# EAGLE design BOB_O1000-W29Y2011 (EAGLE 5.10)
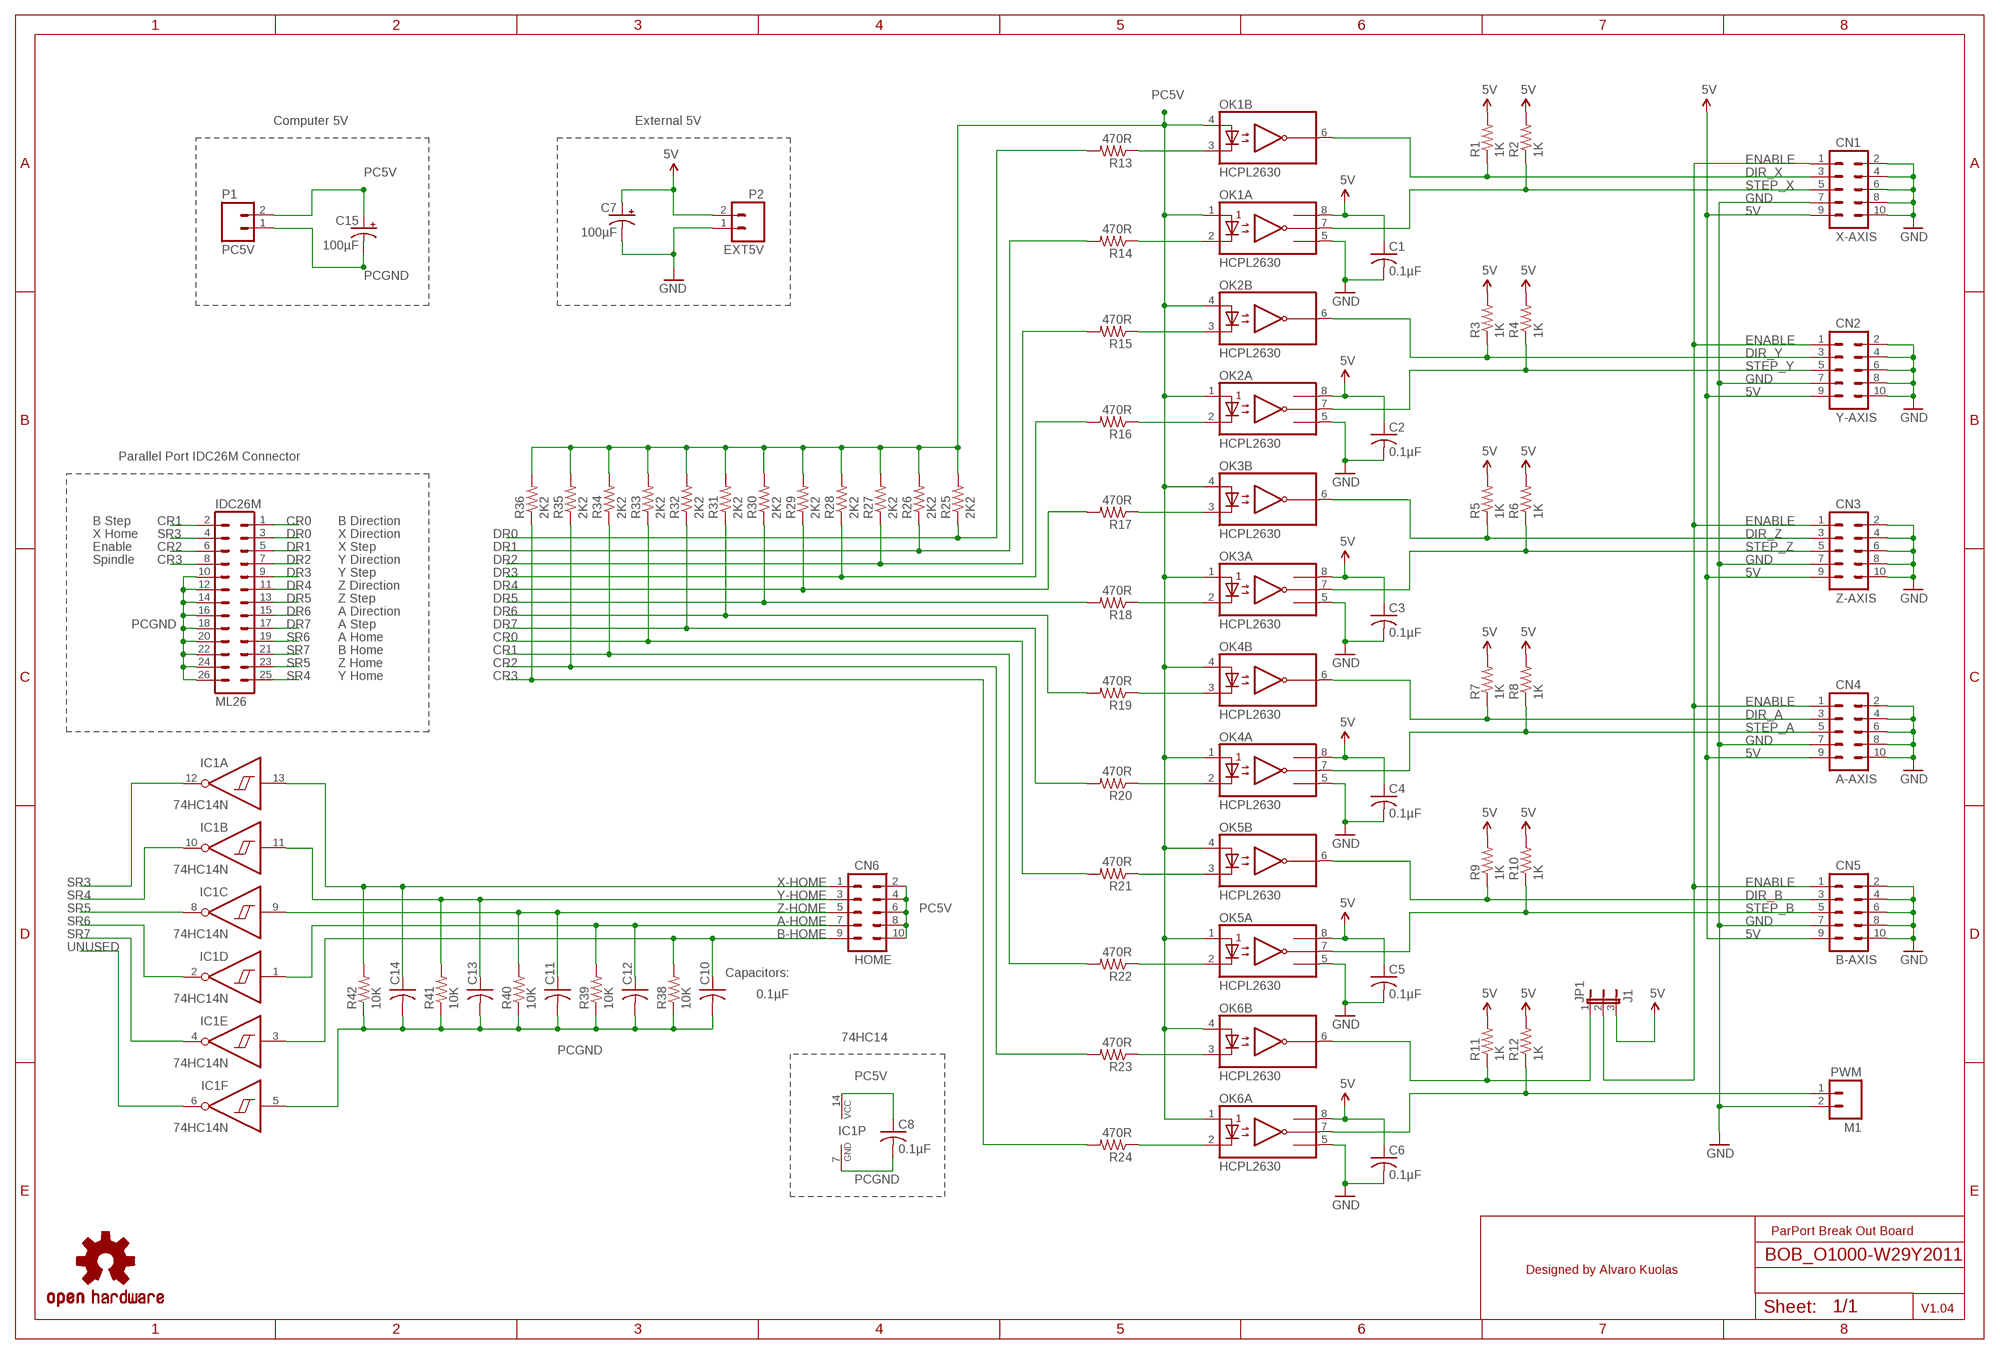
[diagram p0: schematic, sheet 1]

## Parts
C1  0.1µF  C-US050-024X044  [C050-024X044]
C2  0.1µF  C-US050-024X044  [C050-024X044]
C3  0.1µF  C-US050-024X044  [C050-024X044]
C4  0.1µF  C-US050-024X044  [C050-024X044]
C5  0.1µF  C-US050-024X044  [C050-024X044]
C6  0.1µF  C-US050-024X044  [C050-024X044]
C7  100µF  CPOL-USE5-10.5  [E5-10,5]
C8  0.1µF  C-US050-024X044  [C050-024X044]
C10  0.1µF  C-US050-024X044  [C050-024X044]
C11  0.1µF  C-US050-024X044  [C050-024X044]
C12  0.1µF  C-US050-024X044  [C050-024X044]
C13  0.1µF  C-US050-024X044  [C050-024X044]
C14  0.1µF  C-US050-024X044  [C050-024X044]
C15  100µF  CPOL-USE5-10.5  [E5-10,5]
CN1  X-AXIS  M05X2SHD  [2X5-SHROUDED]
CN2  Y-AXIS  M05X2SHD  [2X5-SHROUDED]
CN3  Z-AXIS  M05X2SHD  [2X5-SHROUDED]
CN4  A-AXIS  M05X2SHD  [2X5-SHROUDED]
CN5  B-AXIS  M05X2SHD  [2X5-SHROUDED]
CN6  HOME  M05X2SHD  [2X5-SHROUDED]
IC1  74HC14N  [DIL14]
JP1  J1  JUMPER-3PTH  [1X03]
M1  PWM  M02PTH  [1X02]
ML26  IDC26M  ML26  [ML26]
OK1  HCPL2630  [DIL08]
OK2  HCPL2630  [DIL08]
OK3  HCPL2630  [DIL08]
OK4  HCPL2630  [DIL08]
OK5  HCPL2630  [DIL08]
OK6  HCPL2630  [DIL08]
P1  PC5V  M023.5MM  [SCREWTERMINAL-3.5MM-2]
P2  EXT5V  M023.5MM  [SCREWTERMINAL-3.5MM-2]
R1  1K  R-US_0204/5  [0204/5]
R2  1K  R-US_0204/5  [0204/5]
R3  1K  R-US_0204/5  [0204/5]
R4  1K  R-US_0204/5  [0204/5]
R5  1K  R-US_0204/5  [0204/5]
R6  1K  R-US_0204/5  [0204/5]
R7  1K  R-US_0204/5  [0204/5]
R8  1K  R-US_0204/5  [0204/5]
R9  1K  R-US_0204/5  [0204/5]
R10  1K  R-US_0204/5  [0204/5]
R11  1K  R-US_0204/5  [0204/5]
R12  1K  R-US_0204/5  [0204/5]
R13  470R  R-US_0204/5  [0204/5]
R14  470R  R-US_0204/5  [0204/5]
R15  470R  R-US_0204/5  [0204/5]
R16  470R  R-US_0204/5  [0204/5]
R17  470R  R-US_0204/5  [0204/5]
R18  470R  R-US_0204/5  [0204/5]
R19  470R  R-US_0204/5  [0204/5]
R20  470R  R-US_0204/5  [0204/5]
R21  470R  R-US_0204/5  [0204/5]
R22  470R  R-US_0204/5  [0204/5]
R23  470R  R-US_0204/5  [0204/5]
R24  470R  R-US_0204/5  [0204/5]
R25  2K2  R-US_0204/5  [0204/5]
R26  2K2  R-US_0204/5  [0204/5]
R27  2K2  R-US_0204/5  [0204/5]
R28  2K2  R-US_0204/5  [0204/5]
R29  2K2  R-US_0204/5  [0204/5]
R30  2K2  R-US_0204/5  [0204/5]
R31  2K2  R-US_0204/5  [0204/5]
R32  2K2  R-US_0204/5  [0204/5]
R33  2K2  R-US_0204/5  [0204/5]
R34  2K2  R-US_0204/5  [0204/5]
R35  2K2  R-US_0204/5  [0204/5]
R36  2K2  R-US_0204/5  [0204/5]
R38  10K  R-US_0204/5  [0204/5]
R39  10K  R-US_0204/5  [0204/5]
R40  10K  R-US_0204/5  [0204/5]
R41  10K  R-US_0204/5  [0204/5]
R42  10K  R-US_0204/5  [0204/5]
U$24  OSHW-LOGOL  [OSHW-LOGO-L]

## Nets
5V: C1.1 C2.1 C3.1 C4.1 C5.1 C6.1 C7.+ CN1.9 CN2.9 CN3.9 CN4.9 CN5.9 JP1.3 OK1.8(A:VCC) OK2.8(A:VCC) OK3.8(A:VCC) OK4.8(A:VCC) OK5.8(A:VCC) OK6.8(A:VCC) P2.2 R1.2 R2.2 R3.2 R4.2 R5.2 R6.2 R7.2 R8.2 R9.2 R10.2 R11.2 R12.2
A-HOME: C12.1 CN6.7 IC1.1(D:I) R39.2
B-HOME: C10.1 CN6.9 IC1.3(E:I) R38.2
CR0: ML26.1 R21.2 R33.1
CR1: ML26.2 R22.2 R34.1
CR2: ML26.6 R23.2 R35.1
CR3: ML26.8 R24.2 R36.1
DIR_A: CN4.3 OK4.6(B:VO2) R7.1
DIR_B: CN5.3 OK5.6(B:VO2) R9.1
DIR_X: CN1.3 OK1.6(B:VO2) R1.1
DIR_Y: CN2.3 OK2.6(B:VO2) R3.1
DIR_Z: CN3.3 OK3.6(B:VO2) R5.1
DR0: ML26.3 R13.2 R25.1
DR1: ML26.5 R14.2 R26.1
DR2: ML26.7 R15.2 R27.1
DR3: ML26.9 R16.2 R28.1
DR4: ML26.11 R17.2 R29.1
DR5: ML26.13 R18.2 R30.1
DR6: ML26.15 R19.2 R31.1
DR7: ML26.17 R20.2 R32.1
ENABLE: CN1.1 CN2.1 CN3.1 CN4.1 CN5.1 JP1.2
GND: C1.2 C2.2 C3.2 C4.2 C5.2 C6.2 C7.- CN1.2 CN1.4 CN1.6 CN1.7 CN1.8 CN1.10 CN2.2 CN2.4 CN2.6 CN2.7 CN2.8 CN2.10 CN3.2 CN3.4 CN3.6 CN3.7 CN3.8 CN3.10 CN4.2 CN4.4 CN4.6 CN4.7 CN4.8 CN4.10 CN5.2 CN5.4 CN5.6 CN5.7 CN5.8 CN5.10 M1.2 OK1.5(A:GND) OK2.5(A:GND) OK3.5(A:GND) OK4.5(A:GND) OK5.5(A:GND) OK6.5(A:GND) P2.1
N$1: OK6.2(A:C1) R24.1
N$2: JP1.1 OK6.6(B:VO2) R11.1
N$3: M1.1 OK6.7(A:VO1) R12.1
N$4: OK6.3(B:C2) R23.1
N$5: OK1.2(A:C1) R14.1
N$6: OK1.3(B:C2) R13.1
N$17: OK2.3(B:C2) R15.1
N$18: OK2.2(A:C1) R16.1
N$19: OK3.3(B:C2) R17.1
N$20: OK3.2(A:C1) R18.1
N$21: OK4.3(B:C2) R19.1
N$22: OK4.2(A:C1) R20.1
N$23: OK5.3(B:C2) R21.1
N$24: OK5.2(A:C1) R22.1
PC5V: C8.1 C15.+ CN6.2 CN6.4 CN6.6 CN6.8 CN6.10 IC1.14(P:VCC) OK1.1(A:A1) OK1.4(B:A2) OK2.1(A:A1) OK2.4(B:A2) OK3.1(A:A1) OK3.4(B:A2) OK4.1(A:A1) OK4.4(B:A2) OK5.1(A:A1) OK5.4(B:A2) OK6.1(A:A1) OK6.4(B:A2) P1.2 R25.2 R26.2 R27.2 R28.2 R29.2 R30.2 R31.2 R32.2 R33.2 R34.2 R35.2 R36.2
PCGND: C8.2 C10.2 C11.2 C12.2 C13.2 C14.2 C15.- IC1.5(F:I) IC1.7(P:GND) ML26.10 ML26.12 ML26.14 ML26.16 ML26.18 ML26.20 ML26.22 ML26.24 ML26.26 P1.1 R38.1 R39.1 R40.1 R41.1 R42.1
SR3: IC1.12(A:O) ML26.4
SR4: IC1.10(B:O) ML26.25
SR5: IC1.8(C:O) ML26.23
SR6: IC1.2(D:O) ML26.19
SR7: IC1.4(E:O) ML26.21
STEP_A: CN4.5 OK4.7(A:VO1) R8.1
STEP_B: CN5.5 OK5.7(A:VO1) R10.1
STEP_X: CN1.5 OK1.7(A:VO1) R2.1
STEP_Y: CN2.5 OK2.7(A:VO1) R4.1
STEP_Z: CN3.5 OK3.7(A:VO1) R6.1
UNUSED: IC1.6(F:O)
X-HOME: C14.1 CN6.1 IC1.13(A:I) R42.2
Y-HOME: C13.1 CN6.3 IC1.11(B:I) R41.2
Z-HOME: C11.1 CN6.5 IC1.9(C:I) R40.2

## Notes on the sheet
- Computer 5V | External 5V
- Parallel Port IDC26M Connector
- B Step | B Direction
- X Home | X Direction
- Enable | X Step
- Spindle | Y Direction
- Y Step
- Z Direction
- Z Step
- A Direction
- A Step
- A Home
- B Home
- Z Home
- Y Home
- Capacitors:
- 74HC14
- ParPort Break Out Board
- Designed by Alvaro Kuolas
- V1.04

## Library data of the parts
C1-C6 C8 C10-C14 = rcl-2:C-US: CAPACITOR, American symbol
C7 C15 = rcl-2:CPOL-US: POLARIZED CAPACITOR, American symbol
CN1-CN6 = SparkFun:M05X2: Header 5x2 Standard 10-pin dual row 0.1" header. Commonly used with AVR-ISP. Use with Spark Fun Electronics SKU: PRT-00778
IC1 = 74xx-eu:74*14: Hex schmitt trigger INVERTER
JP1 = SparkFun:JUMPER-3
M1 P1 P2 = SparkFun:M02: Header 2 Standard 2-pin 0.1" header. Use with straight break away headers (SKU : PRT-00116), right angle break away headers (PRT-00553), swiss pins (PRT-00743), machine pins (PRT-00117), and female headers (PRT-00115). Molex polarized connector foot print use with SKU : PRT-08233 with associated crimp pins and housings.
ML26 = con-harting-ml:ML26: HARTING
OK1-OK5 = optocoupler-2:HCPL2630: HEWLETT PACKARD OPTO COUPLER
OK6 = optocoupler:HCPL2630: HEWLETT PACKARD OPTO COUPLER
R1-R36 R38-R42 = rcl-2:R-US_: RESISTOR, American symbol
U$24 = SparkFun:OSHW-LOGO: Open Source Hardware Logo This logo indicates the piece of hardware it is found on incorporates a OSHW license and/or adheres to the definition of open source hardware found here: http://freedomdefined.org/OSHW

## Board
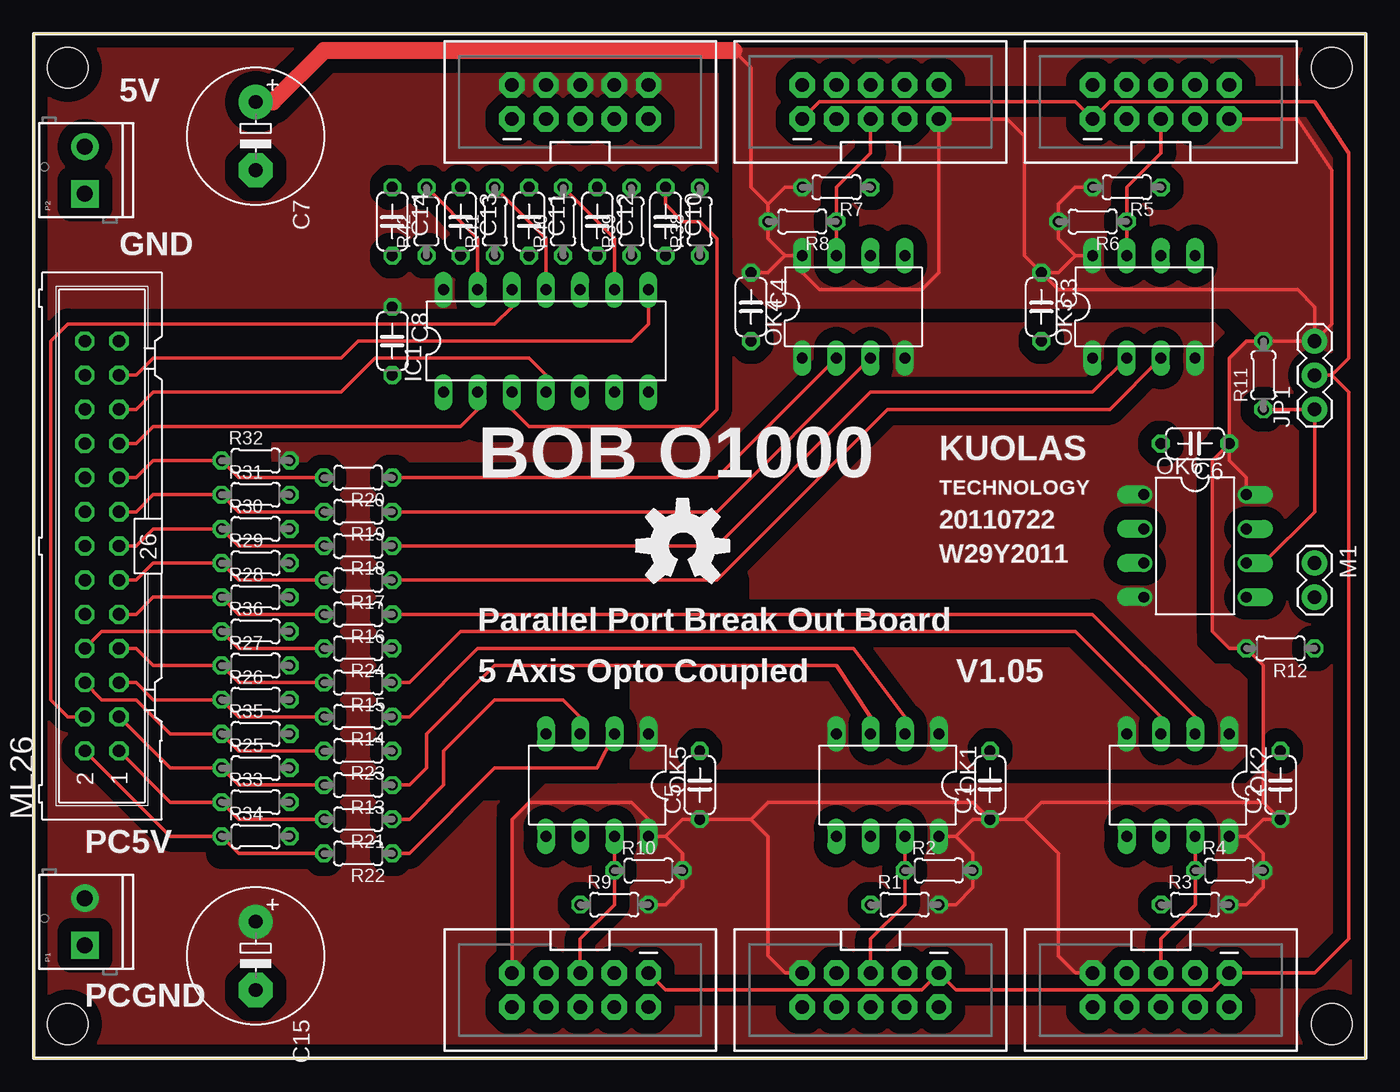
[diagram p1: board, top side]
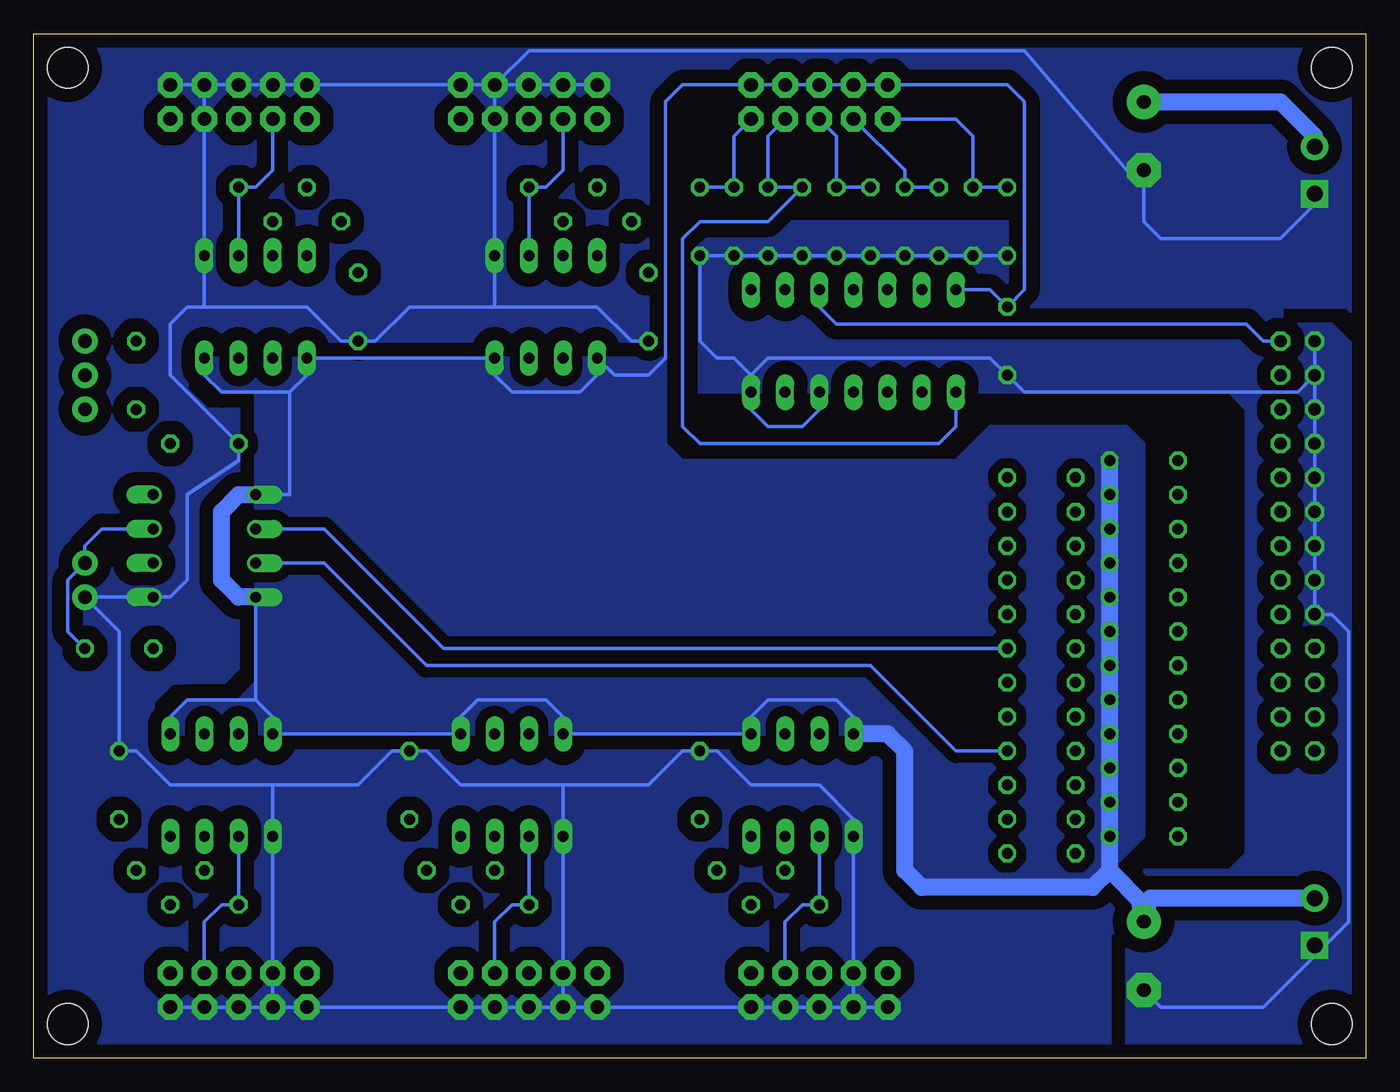
[diagram p2: board, bottom side, seen from below]

Size 99.06 x 76.2 mm. Coordinates in mm from the lower left corner, seen from the top.
Outline: 0,0 99.06,0 99.06,76.2 0,76.19 0,0
Copper layers (1*16): Top 0.035mm / dielectric 1.5mm / Bottom 0.035mm
Design rules "ITead_rule": minimum track width 6mil, minimum drill 12mil, track to track 6mil, track to pad 6mil, pad to pad 6mil, via to via 6mil, smd to smd 0mil, copper to edge 10mil, drill to drill 10mil, minimum pad ring 10mil, minimum via ring 6mil, stop-mask expansion 2mil, vias tented up to drill 100mil, thermal gap 10mil
Holes 3.05 mm at 2.54,73.66 96.52,73.66 96.52,2.54 2.54,2.54
tRestrict: area 14,15.2 to 19.1,43.2; area 15.2,44.5 to 16.5,45.7; area 33,47 to 38.1,48.3; area 33,20.3 to 40.6,26.7; area 41.9,21.6 to 43.2,27.9; area 29.2,33 to 52.1,35.6

### Footprints (pad centres in the part's own frame; a part is rotated, then mirrored left to right if it is on the bottom)
C050-024X044 = drill 0.813 octagon: 1 -2.54,0; 2 2.54,0
E5-10,5 = drill 1.016 pad 2.54 round: + -2.54,0 | drill 1.016 pad 2.54 octagon: - 2.54,0
2X5-SHROUDED = drill 1.016 pad 1.88 octagon: 1 -1.27,5.08; 2 1.27,5.08; 3 -1.27,2.54; 4 1.27,2.54; 5 -1.27,0; 6 1.27,0; 7 -1.27,-2.54; 8 1.27,-2.54; 9 -1.27,-5.08; 10 1.27,-5.08
DIL14 = drill 0.813 long: 1 -7.62,-3.81; 2 -5.08,-3.81; 3 -2.54,-3.81; 4 0,-3.81; 5 2.54,-3.81; 6 5.08,-3.81; 7 7.62,-3.81; 8 7.62,3.81; 9 5.08,3.81; 10 2.54,3.81; 11 0,3.81; 12 -2.54,3.81; 13 -5.08,3.81; 14 -7.62,3.81
1X03 = drill 1.016 pad 1.88 round: 1 -2.54,0; 2 0,0; 3 2.54,0
1X02 = drill 1.016 pad 1.88 round: 1 -1.27,0; 2 1.27,0
ML26 = drill 0.914 octagon: 1 -15.24,-1.27; 2 -15.24,1.27; 3 -12.7,-1.27; 4 -12.7,1.27; 5 -10.16,-1.27; 6 -10.16,1.27; 7 -7.62,-1.27; 8 -7.62,1.27; 9 -5.08,-1.27; 10 -5.08,1.27; 11 -2.54,-1.27; 12 -2.54,1.27; 13 0,-1.27; 14 0,1.27; 15 2.54,-1.27; 16 2.54,1.27; 17 5.08,-1.27; 18 5.08,1.27; 19 7.62,-1.27; 20 7.62,1.27; 21 10.16,-1.27; 22 10.16,1.27; 23 12.7,-1.27; 24 12.7,1.27; 25 15.24,-1.27; 26 15.24,1.27
DIL08 = drill 0.813 long: 1 -3.81,-3.81; 2 -1.27,-3.81; 3 1.27,-3.81; 4 3.81,-3.81; 5 3.81,3.81; 6 1.27,3.81; 7 -1.27,3.81; 8 -3.81,3.81
DIL08' = drill 0.813 offset: 1 -3.81,-3.81; 2 -1.27,-3.81; 3 1.27,-3.81; 4 3.81,-3.81; 5 3.81,3.81; 6 1.27,3.81; 7 -1.27,3.81; 8 -3.81,3.81
SCREWTERMINAL-3.5MM-2 = drill 1.2 pad 2.032 square: 1 -1.753,0 | drill 1.2 pad 2.032 round: 2 1.747,0
0204/5 = drill 0.813 octagon: 1 -2.54,0; 2 2.54,0

### Placement (x,y rotation side)
C1  71.12,20.32 90 top
C2  92.71,20.32 90 top
C3  74.93,55.88 270 top
C4  53.34,55.88 270 top
C5  49.53,20.32 90 top
C6  86.36,45.72 180 top
C7  16.51,68.58 270 top
C8  26.67,53.34 270 top
C10  46.99,62.23 270 top
C11  36.83,62.23 270 top
C12  41.91,62.23 270 top
C13  31.75,62.23 270 top
C14  26.67,62.23 270 top
C15  16.51,7.62 270 top
CN1  62.23,5.08 270 top
CN2  83.82,5.08 270 top
CN3  83.82,71.12 90 top
CN4  62.23,71.12 90 top
CN5  40.64,5.08 270 top
CN6  40.64,71.12 90 top
IC1  38.1,53.34 0 top
JP1  95.25,50.8 90 top
M1  95.25,35.56 270 top
ML26  5.08,38.1 90 top
OK1  63.5,20.32 180 top
OK2  85.09,20.32 180 top
OK3  82.55,55.88 0 top
OK4  60.96,55.88 0 top
OK5  41.91,20.32 180 top
OK6  HCPL2630  [DIL08']  86.36,38.1 270 top
P1  3.81,10.16 90 top
P2  3.81,66.04 90 top
R1  64.77,11.43 0 top
R2  67.31,13.97 0 top
R3  86.36,11.43 0 top
R4  88.9,13.97 0 top
R5  81.28,64.77 180 top
R6  78.74,62.23 180 top
R7  59.69,64.77 180 top
R8  57.15,62.23 180 top
R9  43.18,11.43 0 top
R10  45.72,13.97 0 top
R11  91.44,50.8 90 top
R12  92.71,30.48 180 top
R13  24.13,20.32 180 top
R14  24.13,25.4 180 top
R15  24.13,27.94 180 top
R16  24.13,33.02 180 top
R17  24.13,35.56 180 top
R18  24.13,38.1 180 top
R19  24.13,40.64 180 top
R20  24.13,43.18 180 top
R21  24.13,17.78 180 top
R22  24.13,15.24 180 top
R23  24.13,22.86 180 top
R24  24.13,30.48 180 top
R25  16.51,21.59 0 top
R26  16.51,26.67 0 top
R27  16.51,29.21 0 top
R28  16.51,34.29 0 top
R29  16.51,36.83 0 top
R30  16.51,39.37 0 top
R31  16.51,41.91 0 top
R32  16.51,44.45 0 top
R33  16.51,19.05 0 top
R34  16.51,16.51 0 top
R35  16.51,24.13 0 top
R36  16.51,31.75 0 top
R38  49.53,62.23 90 top
R39  44.45,62.23 90 top
R40  39.37,62.23 90 top
R41  34.29,62.23 90 top
R42  29.21,62.23 90 top
U$24  48.26,38.1 0 top

### Tracks (layer width: path | path; a pad name or v marks a point on that pad's centre or on a via)
5V
  Top 0.254: 46.99,16.51 OK5.8 45.72,17.78 44.45,19.05 36.83,19.05 35.56,17.78 CN5.9 | 46.99,16.51 48.26,15.24 R10.2 48.26,12.7 46.99,11.43 R9.2 | 46.99,16.51 48.26,17.78 C5.1 53.34,17.78 | CN1.9 55.88,6.35 54.61,7.62 54.61,16.51 53.34,17.78 | CN2.9 77.47,6.35 76.2,7.62 76.2,15.24 73.66,17.78 | C1.1 73.66,17.78 | 68.58,16.51 OK1.8 | 68.58,16.51 69.85,15.24 R2.2 69.85,12.7 68.58,11.43 R1.2 | C1.1 69.85,17.78 68.58,16.51 | 53.34,17.78 54.61,19.05 69.85,19.05 C1.1 | 73.66,17.78 74.93,19.05 91.44,19.05 | 91.44,19.05 C2.1 91.44,17.78 90.17,16.51 | R3.2 90.17,11.43 91.44,12.7 R4.2 91.44,15.24 90.17,16.51 | 90.17,16.51 OK2.8 | C6.1 88.9,44.45 90.17,43.18 OK6.8 | C6.1 87.63,44.45 87.63,31.75 88.9,30.48 R12.2 91.44,29.21 91.44,19.05 | C6.1 88.9,52.07 90.17,53.34 R11.2 JP1.3 | R5.2 77.47,64.77 76.2,63.5 R6.2 76.2,60.96 77.47,59.69 | 77.47,59.69 OK3.8 | 77.47,59.69 76.2,58.42 C3.1 | C3.1 76.2,57.15 93.98,57.15 95.25,55.88 JP1.3 | 55.88,59.69 OK4.8 57.15,58.42 58.42,57.15 66.04,57.15 67.31,58.42 CN4.9 72.39,69.85 73.66,68.58 73.66,59.69 C3.1 | 55.88,59.69 54.61,60.96 R8.2 54.61,63.5 | 54.61,63.5 55.88,64.77 R7.2 | C4.1 54.61,58.42 55.88,59.69 | CN3.9 93.98,69.85 96.52,66.04 96.52,54.61 JP1.3 | 52.07,74.93 53.34,73.66 53.34,64.77 54.61,63.5
  Top 1.27: C7.+ 17.78,71.12 21.59,74.93 52.07,74.93
  Bottom 1.27: C7.+ 6.35,71.12 3.81,68.58 P2.2
  pour Top (isolate 1.016, no thermals): 35.56,5.08 99.06,5.08 99.06,21.59 91.44,21.59 90.17,20.32 38.1,20.32 35.56,17.78
  pour Top (isolate 1.016, no thermals): 91.44,19.05 99.06,19.05 99.06,53.34 90.17,53.34 88.9,52.07 88.9,45.72 87.63,44.45 87.63,31.75 88.9,30.48 90.17,30.48 91.44,29.21
  pour Top (isolate 1.016, no thermals): 99.06,76.2 52.07,76.2 52.07,58.42 54.61,55.88 88.9,55.88 91.44,53.34 99.06,53.34
A-HOME
  Bottom 0.254: CN6.7 44.45,68.58 R39.2 C12.1 44.45,62.23 49.53,62.23 50.8,60.96 50.8,46.99 49.53,45.72 31.75,45.72 30.48,46.99 IC1.1
B-HOME
  Top 0.254: C10.1 46.99,63.5 48.26,62.23 49.53,62.23 50.8,60.96 50.8,48.26 49.53,46.99 36.83,46.99 35.56,48.26 IC1.3
  Bottom 0.254: R38.2 C10.1 46.99,68.58 CN6.9
CR0
  Top 0.254: R21.2 15.24,17.78 R33.1 10.16,19.05 ML26.1
CR1
  Top 0.254: R22.2 15.24,15.24 R34.1 10.16,16.51 ML26.2
CR2
  Top 0.254: R23.2 15.24,22.86 R35.1 10.16,24.13 7.62,26.67 5.08,26.67 ML26.6
CR3
  Top 0.254: R24.2 15.24,30.48 R36.1 5.08,31.75 ML26.8
DIR_A
  Bottom 0.254: OK4.6 R7.1 60.96,64.77 59.69,66.04 CN4.3
DIR_B
  Bottom 0.254: CN5.3 43.18,10.16 41.91,11.43 R9.1 OK5.6
DIR_X
  Bottom 0.254: CN1.3 64.77,10.16 63.5,11.43 R1.1 OK1.6
DIR_Y
  Bottom 0.254: OK2.6 R3.1 85.09,11.43 86.36,10.16 CN2.3
DIR_Z
  Bottom 0.254: OK3.6 R5.1 82.55,64.77 81.28,66.04 CN3.3
DR0
  Top 0.254: R13.2 15.24,20.32 R25.1 10.16,21.59 ML26.3
DR1
  Top 0.254: R14.2 15.24,25.4 R26.1 8.89,26.67 7.62,27.94 ML26.5
DR2
  Top 0.254: R15.2 15.24,27.94 R27.1 8.89,29.21 7.62,30.48 ML26.7
DR3
  Top 0.254: R16.2 15.24,33.02 R28.1 8.89,34.29 7.62,33.02 ML26.9
DR4
  Top 0.254: R17.2 15.24,35.56 R29.1 8.89,36.83 7.62,35.56 ML26.11
DR5
  Top 0.254: R18.2 15.24,38.1 R30.1 8.89,39.37 7.62,38.1 ML26.13
DR6
  Top 0.254: R19.2 15.24,40.64 R31.1 8.89,41.91 7.62,40.64 ML26.15
DR7
  Top 0.254: R20.2 15.24,43.18 R32.1 8.89,44.45 7.62,43.18 ML26.17
ENABLE
  Top 0.254: CN5.1 46.99,5.08 66.04,5.08 CN1.1 68.58,5.08 87.63,5.08 CN2.1 95.25,6.35 97.79,8.89 97.79,49.53 96.52,50.8 | 96.52,50.8 JP1.2 | 96.52,50.8 97.79,52.07 97.79,67.31 95.25,71.12 80.01,71.12 CN3.1 77.47,71.12 58.42,71.12 CN4.1
GND
  Bottom 0.254: CN5.10 CN5.8 | CN5.8 CN5.7 OK5.5 38.1,17.78 40.64,20.32 45.72,20.32 48.26,22.86 C5.2 50.8,22.86 53.34,20.32 59.69,20.32 | CN5.8 CN5.6 CN5.4 CN5.2 CN1.10 CN1.8 | CN1.8 CN1.6 CN1.4 CN1.2 CN2.10 CN2.8 | CN2.8 CN2.6 CN2.4 CN2.2 | CN1.8 CN1.7 OK1.5 59.69,20.32 | CN2.8 CN2.7 OK2.5 81.28,20.32 | 59.69,20.32 67.31,20.32 69.85,22.86 C1.2 72.39,22.86 74.93,20.32 81.28,20.32 | 81.28,20.32 88.9,20.32 91.44,22.86 C2.2 92.71,31.75 M1.2 OK6.5 88.9,34.29 87.63,35.56 87.63,41.91 83.82,44.45 C6.2 88.9,50.8 88.9,54.61 87.63,55.88 86.36,55.88 | 86.36,55.88 78.74,55.88 76.2,53.34 C3.2 73.66,53.34 71.12,55.88 64.77,55.88 | CN3.8 CN3.10 | CN3.8 CN3.6 CN3.4 CN3.2 CN4.10 CN4.8 | CN4.8 CN4.6 CN4.4 CN4.2 | CN4.8 CN4.7 OK4.5 64.77,55.88 | CN3.8 CN3.7 OK3.5 86.36,55.88 | 64.77,55.88 57.15,55.88 54.61,53.34 C4.2 | P2.1 3.81,63.5 6.35,60.96 15.24,60.96 16.51,62.23 C7.- 17.78,66.04 25.4,74.93 62.23,74.93 CN4.8
  pour Bottom (isolate 1.016, rank 2, no thermals): 0,0 99.06,0 99.06,76.2 0,76.2
N$1
  Bottom 0.254: R24.1 68.58,30.48 77.47,39.37 OK6.2
N$2
  Top 0.254: OK6.6 91.44,36.83 95.25,40.64 JP1.1 R11.1
N$3
  Bottom 0.254: OK6.7 93.98,39.37 95.25,38.1 M1.1 96.52,35.56 96.52,31.75 R12.1
N$4
  Bottom 0.254: OK6.3 77.47,36.83 69.85,29.21 36.83,29.21 30.48,22.86 R23.1
N$5
  Top 0.254: OK1.2 64.77,25.4 60.96,30.48 33.02,30.48 27.94,25.4 R14.1
N$6
  Top 0.254: R13.1 27.94,20.32 29.21,21.59 29.21,24.13 34.29,29.21 59.69,29.21 62.23,25.4 OK1.3
N$17
  Top 0.254: OK2.3 83.82,25.4 77.47,31.75 31.75,31.75 27.94,27.94 R15.1
N$18
  Top 0.254: OK2.2 86.36,25.4 78.74,33.02 R16.1
N$19
  Top 0.254: R17.1 50.8,35.56 63.5,48.26 80.01,48.26 OK3.3
N$20
  Top 0.254: R18.1 50.8,38.1 62.23,49.53 78.74,49.53 OK3.2
N$21
  Top 0.254: R19.1 50.8,40.64 OK4.3
N$22
  Top 0.254: R20.1 50.8,43.18 OK4.2
N$23
  Top 0.254: R21.1 27.94,17.78 30.48,20.32 30.48,22.86 34.29,26.67 39.37,26.67 40.64,25.4 OK5.3
N$24
  Top 0.254: R22.1 27.94,15.24 34.29,21.59 41.91,21.59 OK5.2
PC5V
  Bottom 0.254: OK5.4 38.1,25.4 39.37,26.67 44.45,26.67 45.72,25.4 OK5.1 OK1.4 59.69,25.4 60.96,26.67 66.04,26.67 67.31,25.4 OK1.1 OK2.4 81.28,25.4 82.55,26.67 | OK2.1 88.9,25.4 87.63,26.67 82.55,26.67 | 82.55,26.67 OK6.4 | OK6.1 80.01,41.91 80.01,49.53 | OK3.4 86.36,50.8 85.09,49.53 80.01,49.53 | 80.01,49.53 78.74,50.8 OK3.1 OK4.4 64.77,50.8 63.5,49.53 58.42,49.53 57.15,50.8 OK4.1 55.88,50.8 53.34,50.8 52.07,52.07 52.07,71.12 50.8,72.39 CN6.10 CN6.8 CN6.6 CN6.4 CN6.2 26.67,72.39 25.4,71.12 25.4,57.15 C8.1 27.94,57.15 IC1.14 | 16.03,11.91 16.51,11.43
  Bottom 1.27: R32.2 R31.2 R30.2 R29.2 R28.2 R36.2 R27.2 R26.2 R35.2 R25.2 R33.2 R34.2 19.05,13.97 | OK5.4 35.56,24.13 34.29,22.86 34.29,13.97 33.02,12.7 20.32,12.7 19.05,13.97 | OK6.4 83.82,34.29 85.09,35.56 85.09,40.64 83.82,41.91 OK6.1 | P1.2 16.03,11.91 | 16.51,11.43 19.05,13.97
  Bottom 1.778: 16.51,11.43 C15.+
  pour Bottom (isolate 0.762, no thermals): 35.56,24.13 88.9,24.13 88.9,25.4 87.63,26.67 83.82,26.67 82.55,27.94 82.55,49.53 85.09,49.53 86.36,50.8 86.36,52.07 52.07,52.07 52.07,45.72 50.8,44.45 30.48,44.45 27.94,46.99 17.78,46.99 16.51,45.72 16.51,16.51 20.32,12.7 33.02,12.7 34.29,13.97 34.29,22.86
  pour Top (isolate 1.016, rank 2, no thermals): 0,0 99.06,0 99.06,76.2 0,76.2
PCGND
  Bottom 0.254: ML26.24 ML26.26 | ML26.24 ML26.22 ML26.20 ML26.18 ML26.16 ML26.14 ML26.12 ML26.10 2.54,33.02 1.27,31.75 1.27,10.16 3.02,8.41 P1.1 3.81,7.62 7.62,3.81 15.24,3.81 C15.- | C14.2 R42.1 C13.2 R41.1 C11.2 R40.1 C12.2 R39.1 C10.2 R38.1 49.53,53.34 48.26,52.07 46.99,52.07 45.72,50.8 | IC1.5 40.64,48.26 41.91,46.99 44.45,46.99 45.72,48.26 IC1.7 45.72,50.8 | 45.72,50.8 44.45,52.07 27.94,52.07 C8.2 25.4,49.53 5.08,49.53 ML26.24
  pour Bottom (isolate 1.016, no thermals): 0,0 17.78,0 17.78,12.7 16.51,13.97 10.16,13.97 8.89,15.24 8.89,48.26 10.16,49.53 50.8,49.53 50.8,60.96 49.53,62.23 25.4,62.23 24.13,60.96 24.13,55.88 22.86,54.61 2.54,54.61 0,52.07
SR3
  Top 0.254: IC1.12 35.56,55.88 34.29,54.61 2.54,54.61 1.27,53.34 1.27,26.67 2.54,25.4 ML26.4
SR4
  Bottom 0.254: IC1.10 40.64,55.88 39.37,54.61 8.89,54.61 7.62,53.34 ML26.25
SR5
  Top 0.254: IC1.8 45.72,54.61 44.45,53.34 24.13,53.34 22.86,52.07 8.89,52.07 7.62,50.8 ML26.23
SR6
  Top 0.254: ML26.19 7.62,45.72 8.89,46.99 31.75,46.99 33.02,48.26 IC1.2
SR7
  Top 0.254: IC1.4 38.1,50.8 36.83,52.07 25.4,52.07 22.86,49.53 8.89,49.53 7.62,48.26 ML26.21
STEP_A
  Top 0.254: OK4.7 R8.1 59.69,64.77 62.23,67.31 CN4.5
STEP_B
  Top 0.254: CN5.5 40.64,8.89 43.18,11.43 R10.1 OK5.7
STEP_X
  Top 0.254: CN1.5 62.23,8.89 64.77,11.43 R2.1 OK1.7
STEP_Y
  Top 0.254: CN2.5 83.82,8.89 86.36,11.43 R4.1 OK2.7
STEP_Z
  Top 0.254: OK3.7 R6.1 81.28,64.77 83.82,67.31 CN3.5
X-HOME
  Top 0.254: IC1.13 33.02,60.96 R42.2
  Bottom 0.254: C14.1 R42.2 29.21,68.58 30.48,69.85 CN6.1
Y-HOME
  Top 0.254: IC1.11 38.1,60.96 R41.2
  Bottom 0.254: C13.1 R41.2 34.29,66.04 CN6.3
Z-HOME
  Top 0.254: IC1.9 43.18,60.96 R40.2
  Bottom 0.254: C11.1 R40.2 39.37,68.58 CN6.5

### Text on the board
tPlace: 5V | GND | KUOLAS | BOB O1000 | TECHNOLOGY | 20110722 | W29Y2011 | Parallel Port Break Out Board | 5 Axis Opto Coupled | V1.05 | PC5V | PCGND